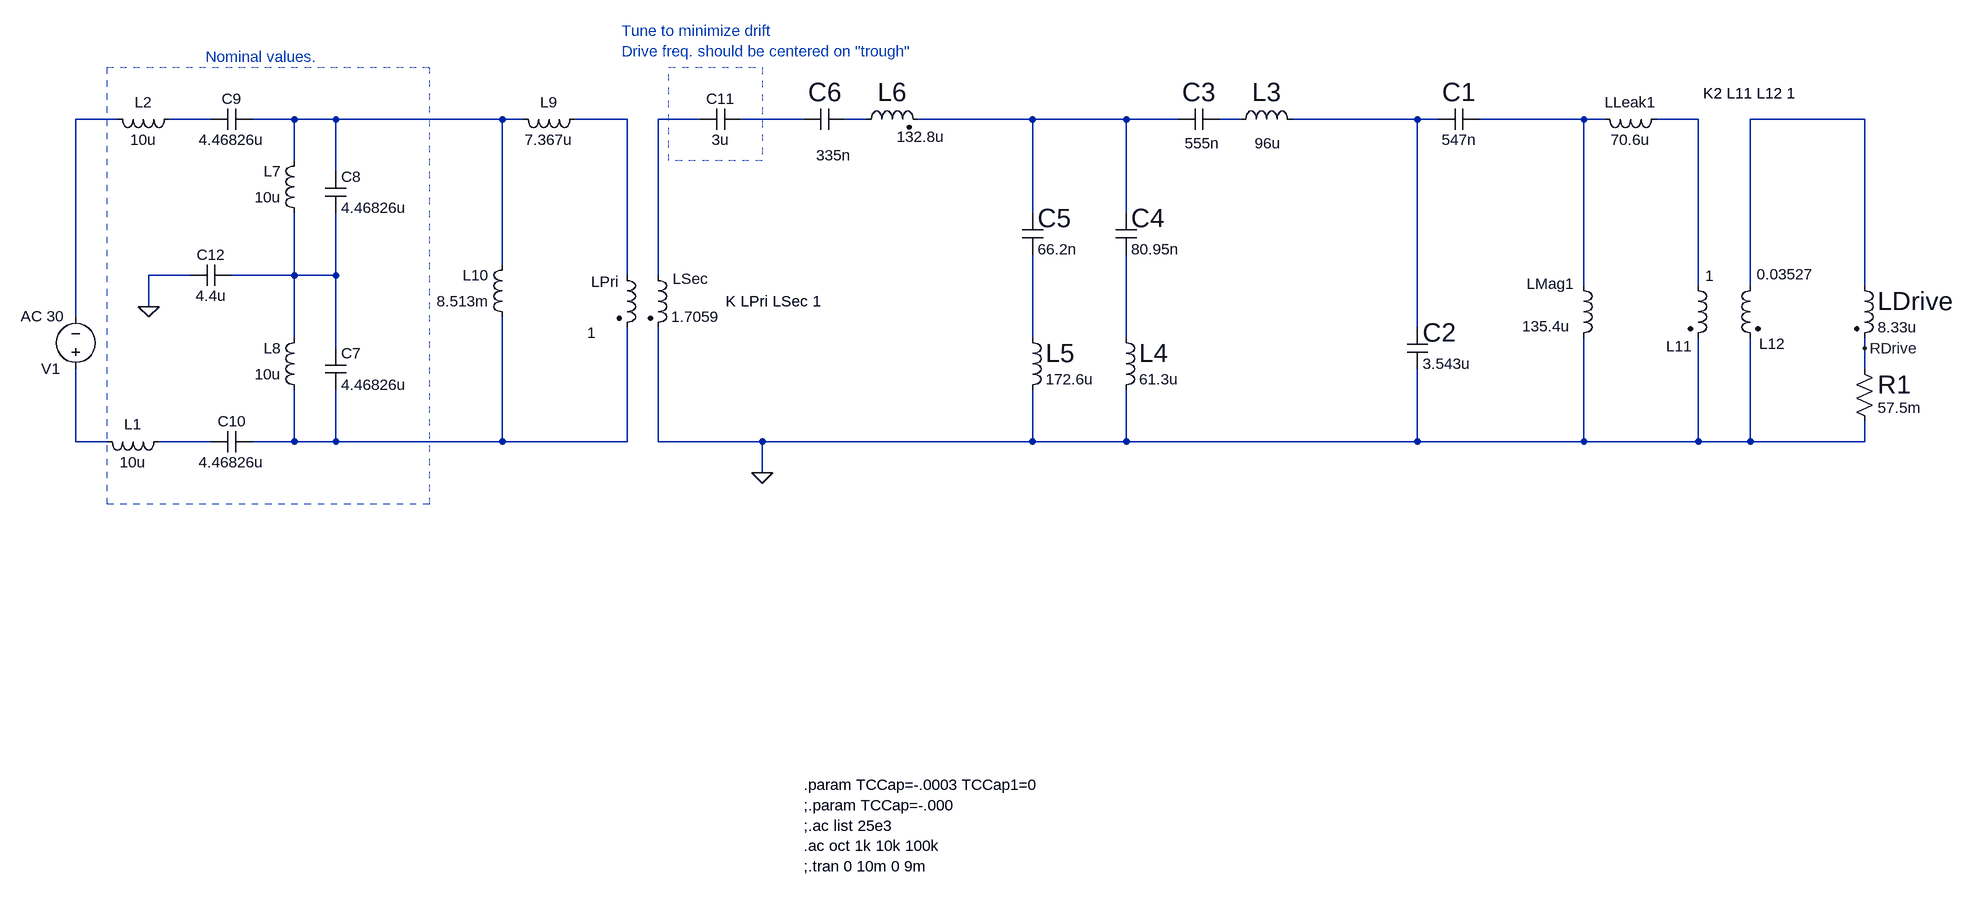
[diagram p0: schematic Tx_Filter_MPS_23,8kHz-Measured-InclCantileverXfmer.asc]
Tx_Filter_MPS_23,8kHz-Measured-InclCantileverXfmer.asc, the LTspice schematic file:
Version 4
SHEET 1 2608 1216
WIRE -464 64 -528 64
WIRE -320 64 -384 64
WIRE -192 64 -256 64
WIRE -128 64 -192 64
WIRE 128 64 -128 64
WIRE 160 64 128 64
WIRE 320 64 240 64
WIRE 432 64 368 64
WIRE 592 64 496 64
WIRE 688 64 656 64
WIRE 944 64 768 64
WIRE 1088 64 944 64
WIRE 1168 64 1088 64
WIRE 1264 64 1232 64
WIRE 1536 64 1344 64
WIRE 1568 64 1536 64
WIRE 1792 64 1632 64
WIRE 1824 64 1792 64
WIRE 1968 64 1904 64
WIRE 2224 64 2048 64
WIRE -192 128 -192 64
WIRE -128 144 -128 64
WIRE 944 208 944 64
WIRE 1088 208 1088 64
WIRE 128 288 128 64
WIRE -352 304 -416 304
WIRE -192 304 -192 208
WIRE -192 304 -288 304
WIRE -128 304 -128 208
WIRE -128 304 -192 304
WIRE 320 304 320 64
WIRE 368 304 368 64
WIRE 1792 320 1792 64
WIRE 1968 320 1968 64
WIRE 2048 320 2048 64
WIRE 2224 320 2224 64
WIRE -416 352 -416 304
WIRE -528 368 -528 64
WIRE 1536 384 1536 64
WIRE -192 400 -192 304
WIRE 944 400 944 272
WIRE 1088 400 1088 272
WIRE -128 416 -128 304
WIRE 2224 416 2224 400
WIRE 2224 448 2224 416
WIRE -528 560 -528 448
WIRE -480 560 -528 560
WIRE -320 560 -400 560
WIRE -192 560 -192 480
WIRE -192 560 -256 560
WIRE -128 560 -128 480
WIRE -128 560 -192 560
WIRE 128 560 128 368
WIRE 128 560 -128 560
WIRE 320 560 320 384
WIRE 320 560 128 560
WIRE 368 560 368 384
WIRE 528 560 368 560
WIRE 944 560 944 480
WIRE 944 560 528 560
WIRE 1088 560 1088 480
WIRE 1088 560 944 560
WIRE 1536 560 1536 448
WIRE 1536 560 1088 560
WIRE 1792 560 1792 400
WIRE 1792 560 1536 560
WIRE 1968 560 1968 400
WIRE 1968 560 1792 560
WIRE 2048 560 2048 400
WIRE 2048 560 1968 560
WIRE 2224 560 2224 528
WIRE 2224 560 2048 560
WIRE 528 608 528 560
FLAG 528 608 0
FLAG -416 352 0
FLAG 2224 416 RDrive
SYMBOL voltage -528 464 R180
WINDOW 123 18 97 Left 2
WINDOW 3 19 111 Invisible 2
SYMATTR Value2 AC 30
SYMATTR Value SINE(0 1 25e3)
SYMATTR SpiceLine Rser=0
SYMATTR InstName V1
SYMBOL ind2 672 80 R270
WINDOW 0 32 56 VTop 4
WINDOW 3 5 100 VBottom 2
SYMATTR InstName L6
SYMATTR Value 132.8u
SYMATTR SpiceLine Rser=361m
SYMATTR Type ind
SYMBOL cap 656 48 R90
WINDOW 0 0 32 VBottom 4
WINDOW 3 56 18 VTop 2
SYMATTR InstName C6
SYMATTR Value 335n
SYMATTR SpiceLine Rpar=5.56k
SYMBOL ind2 2208 304 R0
WINDOW 0 36 40 Left 4
SYMATTR InstName LDrive
SYMATTR Value 8.33u
SYMATTR Type ind
SYMATTR SpiceLine Rser=0
SYMBOL res 2208 432 R0
WINDOW 0 36 40 Left 4
SYMATTR InstName R1
SYMATTR Value 57.5m
SYMBOL cap 1632 48 R90
WINDOW 0 0 32 VBottom 4
WINDOW 3 32 32 VTop 2
SYMATTR InstName C1
SYMATTR Value 547n
SYMATTR SpiceLine Rpar=2.4k
SYMBOL cap 1520 384 R0
WINDOW 0 24 8 Left 4
SYMATTR InstName C2
SYMATTR Value 3.543u
SYMATTR SpiceLine Rpar=148
SYMBOL ind2 304 288 R0
WINDOW 0 -39 26 Left 2
WINDOW 3 -45 104 Left 2
SYMATTR InstName LPri
SYMATTR Value 1
SYMATTR Type ind
SYMBOL ind2 352 288 R0
WINDOW 0 38 21 Left 2
SYMATTR InstName LSec
SYMATTR Value 1.7059
SYMATTR Type ind
SYMBOL ind 1248 80 R270
WINDOW 0 32 56 VTop 4
WINDOW 3 -5 58 VBottom 2
SYMATTR InstName L3
SYMATTR Value 96u
SYMATTR SpiceLine Rser=467m
SYMBOL cap 1232 48 R90
WINDOW 0 0 32 VBottom 4
WINDOW 3 37 27 VTop 2
SYMATTR InstName C3
SYMATTR Value 555n
SYMATTR SpiceLine Rpar=2.7k
SYMBOL ind 1072 384 R0
WINDOW 0 36 40 Left 4
SYMATTR InstName L4
SYMATTR Value 61.3u
SYMATTR SpiceLine Rser=390m
SYMBOL ind 928 384 R0
WINDOW 0 36 40 Left 4
SYMATTR InstName L5
SYMATTR Value 172.6u
SYMATTR SpiceLine Rser=1
SYMBOL cap 1072 208 R0
WINDOW 0 24 8 Left 4
SYMATTR InstName C4
SYMATTR Value 80.95n
SYMATTR SpiceLine Rpar=98k
SYMBOL cap 928 208 R0
WINDOW 0 24 8 Left 4
SYMATTR InstName C5
SYMATTR Value 66.2n
SYMATTR SpiceLine Rpar=280k
SYMBOL ind -384 544 R90
WINDOW 0 5 56 VBottom 2
WINDOW 3 32 56 VTop 2
SYMATTR InstName L1
SYMATTR Value 10u
SYMATTR SpiceLine Rser=50m
SYMBOL ind -368 48 R90
WINDOW 0 5 56 VBottom 2
WINDOW 3 32 56 VTop 2
SYMATTR InstName L2
SYMATTR Value 10u
SYMATTR SpiceLine Rser=50m
SYMBOL cap -144 416 R0
SYMATTR InstName C7
SYMATTR Value 4.46826u
SYMATTR SpiceLine Rpar=300
SYMBOL cap -144 144 R0
SYMATTR InstName C8
SYMATTR Value 4.46826u
SYMATTR SpiceLine Rpar=300
SYMBOL ind -176 224 R180
WINDOW 0 36 80 Left 2
WINDOW 3 36 40 Left 2
SYMATTR InstName L7
SYMATTR Value 10u
SYMATTR SpiceLine Rser=50m
SYMBOL ind -176 496 R180
WINDOW 0 36 80 Left 2
WINDOW 3 36 40 Left 2
SYMATTR InstName L8
SYMATTR Value 10u
SYMATTR SpiceLine Rser=50m
SYMBOL cap -256 48 R90
WINDOW 0 0 32 VBottom 2
WINDOW 3 32 32 VTop 2
SYMATTR InstName C9
SYMATTR Value 4.46826u
SYMATTR SpiceLine Rpar=300
SYMBOL cap -256 544 R90
WINDOW 0 0 32 VBottom 2
WINDOW 3 32 32 VTop 2
SYMATTR InstName C10
SYMATTR Value 4.46826u
SYMATTR SpiceLine Rpar=300
SYMBOL cap -288 288 R90
WINDOW 0 0 32 VBottom 2
WINDOW 3 32 32 VTop 2
SYMATTR InstName C12
SYMATTR Value 4.4u
SYMBOL cap 496 48 R90
WINDOW 0 0 32 VBottom 2
WINDOW 3 32 32 VTop 2
SYMATTR InstName C11
SYMATTR Value 3u
SYMBOL ind 256 48 R90
WINDOW 0 5 56 VBottom 2
WINDOW 3 32 56 VTop 2
SYMATTR InstName L9
SYMATTR Value 7.367u
SYMATTR SpiceLine Rser=130m
SYMBOL ind 144 384 R180
WINDOW 0 36 80 Left 2
WINDOW 3 36 40 Left 2
SYMATTR InstName L10
SYMATTR Value 8.513m
SYMATTR SpiceLine Rser=14
SYMBOL ind2 1952 304 R0
WINDOW 0 -33 109 Left 2
WINDOW 3 27 1 Left 2
SYMATTR InstName L11
SYMATTR Value 1
SYMATTR Type ind
SYMBOL ind2 2064 304 M0
WINDOW 0 -38 105 Left 2
WINDOW 3 -82 -2 Left 2
SYMATTR InstName L12
SYMATTR Value 0.03527
SYMATTR Type ind
SYMBOL ind 1776 304 R0
WINDOW 0 -72 13 Left 2
WINDOW 3 -79 78 Left 2
SYMATTR InstName LMag1
SYMATTR Value 135.4u
SYMATTR SpiceLine Rser=0.189
SYMBOL ind 1920 48 R90
WINDOW 0 5 56 VBottom 2
WINDOW 3 32 56 VTop 2
SYMATTR InstName LLeak1
SYMATTR Value 70.6u
SYMATTR SpiceLine Rser=920m
TEXT 592 1088 Left 2 !.param TCCap=-.0003 TCCap1=0\n;.param TCCap=-.000\n;.ac list 25e3\n.ac oct 1k 10k 100k\n;.tran 0 10m 0 9m
TEXT 472 344 Left 2 !K LPri LSec 1
TEXT -328 -32 Left 2 ;Nominal values.
TEXT 312 -72 Left 2 ;Tune to minimize drift\nDrive freq. should be centered on "trough"
TEXT 1976 24 Left 2 !K2 L11 L12 1
RECTANGLE Normal 16 656 -480 -16 2
RECTANGLE Normal 528 128 384 -16 2

The netlist it stands for:
* Tx_Filter_MPS_23,8kHz-Measured-InclCantileverXfmer.asc
V1 N017 N001 SINE(0 1 25e3) AC 30 Rser=0
L6 N007 N008 132.8u Rser=361m
C6 N007 N006 335n Rpar=5.56k
LDrive N013 RDrive 8.33u Rser=0
R1 RDrive 0 57.5m
C1 N011 N010 547n Rpar=2.4k
C2 N010 0 3.543u Rpar=148
LPri N004 N019 1
LSec N005 0 1.7059
L3 N009 N010 96u Rser=467m
C3 N009 N008 555n Rpar=2.7k
L4 N016 0 61.3u Rser=390m
L5 N015 0 172.6u Rser=1
C4 N008 N016 80.95n Rpar=98k
C5 N008 N015 66.2n Rpar=280k
L1 N018 N017 10u Rser=50m
L2 N002 N001 10u Rser=50m
C7 N014 N019 4.46826u Rpar=300
C8 N003 N014 4.46826u Rpar=300
L7 N014 N003 10u Rser=50m
L8 N019 N014 10u Rser=50m
C9 N003 N002 4.46826u Rpar=300
C10 N019 N018 4.46826u Rpar=300
C12 N014 0 4.4u
C11 N006 N005 3u
L9 N004 N003 7.367u Rser=130m
L10 N019 N003 8.513m Rser=14
L11 N012 0 1
L12 N013 0 0.03527
LMag1 N011 0 135.4u Rser=0.189
LLeak1 N012 N011 70.6u Rser=920m
.param TCCap=-.0003 TCCap1=0
;.param TCCap=-.000
;.ac list 25e3
.ac oct 1k 10k 100k
;.tran 0 10m 0 9m
K LPri LSec 1
* Nominal values.
* Tune to minimize drift
* Drive freq. should be centered on "trough"
K2 L11 L12 1
.backanno
.end